# Altium schematic sheet Bus_Interface_for_ABB-Welcome_v2.schdoc
size 400 x 295 mm
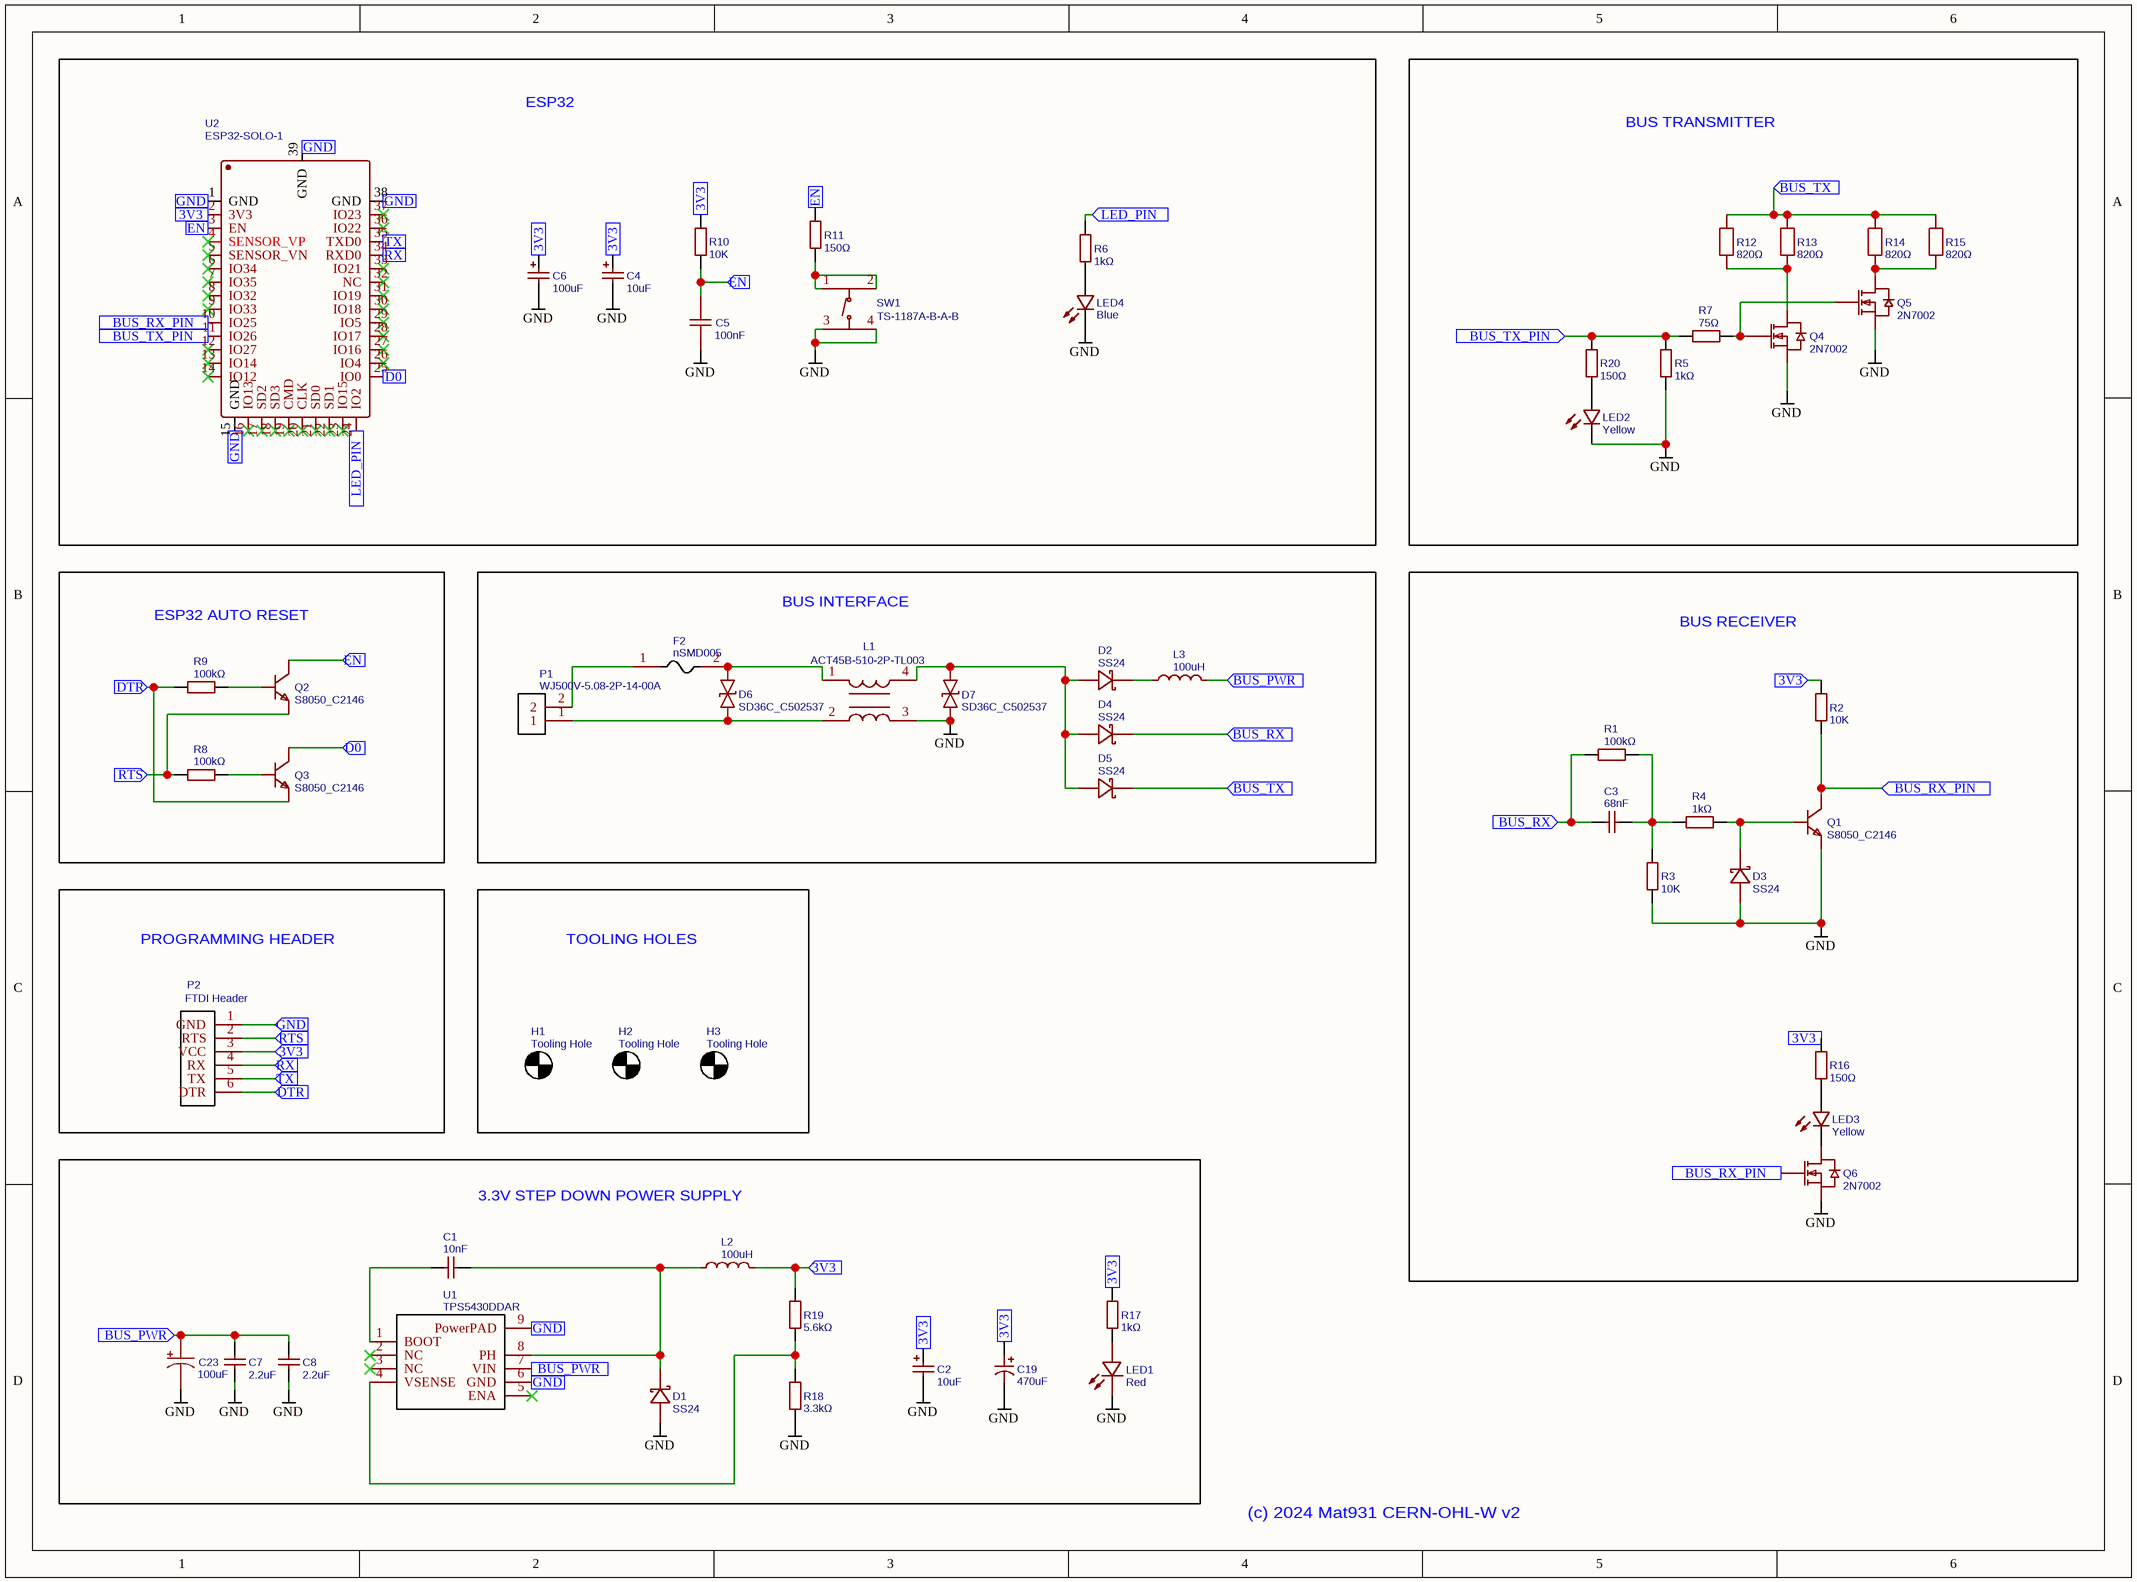
[diagram p0: Bus_Interface_for_ABB-Welcome_v2.schdoc]

## Parts
C1  10nF  [C0603]
C2  10uF  [CAP-SMD_L3.2-W1.6-RD-C7171]
C3  68nF  [C0603]
C4  10uF  [CAP-SMD_L3.2-W1.6-RD-C7171]
C5  100nF  [C0603]
C6  100uF  [CASE-B_3528]
C7  2.2uF  [C1206]
C8  2.2uF  [C1206]
C19  470uF  [CAP-SMD_BD8.0-L8.3-W8.3-LS9.0-FD]
C23  100uF  [CAP-SMD_BD8.0-L8.3-W8.3-RD]
D1  SS24  [SMA_L4.3-W2.6-LS5.0-FD]
D2  SS24  [SMA_L4.3-W2.6-LS5.0-FD]
D3  SS24  [SMA_L4.3-W2.6-LS5.0-FD]
D4  SS24  [SMA_L4.3-W2.6-LS5.0-FD]
D5  SS24  [SMA_L4.3-W2.6-LS5.0-FD]
D6  SD36C_C502537  [SOD-323_L1.7-W1.3-LS2.7-BI]
D7  SD36C_C502537  [SOD-323_L1.7-W1.3-LS2.7-BI]
F2  nSMD005  [F1206]
H1  Tooling Hole  [TOOLING HOLE JLCPCB]
H2  Tooling Hole  [TOOLING HOLE JLCPCB]
H3  Tooling Hole  [TOOLING HOLE JLCPCB]
L1  ACT45B-510-2P-TL003  [IND-SMD_4P-L4.5-W3.2-TL]
L2  100uH  [IND-SMD_L7.1-W6.6]
L3  100uH  [IND-SMD_L7.1-W6.6]
LED1  Red  [LED0603-RD]
LED2  Yellow  [LED0603-RD-YELLOW]
LED3  Yellow  [LED0603-RD-YELLOW]
LED4  Blue  [LED0603-FD_BLUE]
P1  WJ500V-5.08-2P-14-00A  [CONN-TH_2P-P5.00_WJ500V-5.08-2P]
P2  FTDI Header  [FTDI HEADER]
Q1  S8050_C2146  [SOT-23-3_L3.0-W1.7-P0.95-LS2.9-BR]
Q2  S8050_C2146  [SOT-23-3_L3.0-W1.7-P0.95-LS2.9-BR]
Q3  S8050_C2146  [SOT-23-3_L3.0-W1.7-P0.95-LS2.9-BR]
Q4  2N7002  [SOT-23-3_L2.9-W1.3-P1.90-LS2.4-BR]
Q5  2N7002  [SOT-23-3_L2.9-W1.3-P1.90-LS2.4-BR]
Q6  2N7002  [SOT-23-3_L2.9-W1.3-P1.90-LS2.4-BR]
R1  100kΩ  [R0603]
R2  10K  [R0603]
R3  10K  [R0603]
R4  1kΩ  [R0603]
R5  1kΩ  [R0603]
R6  1kΩ  [R0603]
R7  75Ω  [R0603]
R8  100kΩ  [R0603]
R9  100kΩ  [R0603]
R10  10K  [R0603]
R11  150Ω  [R0603]
R12  820Ω  [R2512]
R13  820Ω  [R2512]
R14  820Ω  [R2512]
R15  820Ω  [R2512]
R16  150Ω  [R0603]
R17  1kΩ  [R0603]
R18  3.3kΩ  [R0603]
R19  5.6kΩ  [R0603]
R20  150Ω  [R0603]
SW1  TS-1187A-B-A-B  [SW-SMD_4P-L5.1-W5.1-P3.70-LS6.5-TL-2]
U1  TPS5430DDAR  [ESOP-8_L4.9-W3.9-P1.27-LS6.0-TL-EP]
U2  ESP32-SOLO-1  [WIFIM-SMD_38P-L25.5-W18.0-P1.27]

## Blocks framed on the sheet
ESP32: C4-C6 LED4 R6 R10 R11 SW1 U2
BUS TRANSMITTER: LED2 Q4 Q5 R5 R7 R12-R15 R20
ESP32 AUTO RESET: Q2 Q3 R8 R9
BUS INTERFACE: D2 D4-D7 F2 L1 L3 P1
BUS RECEIVER: C3 D3 LED3 Q1 Q6 R1-R4 R16
PROGRAMMING HEADER: P2
TOOLING HOLES: H1-H3
3.3V STEP DOWN POWER SUPPLY: C1 C2 C7 C8 C19 C23 D1 L2 LED1 R17-R19 U1

## Ports
3V3 (in), BUS_PWR (in), BUS_RX (in), BUS_RX_PIN (in), BUS_TX (in), BUS_TX_PIN (in), D0 (in), DTR (in), EN (in), GND (in), LED_PIN (in), RTS (in), RX (in), TX (in)

## Nets
GND: C2.2 C4.2 C5.1 C6.2 C7.1 C8.1 C19.2 C23.2 D1.1(A) D3.1(A) D7.1 L1.3 LED1.1(K) LED2.1(C) LED4.1(C) Q1.2(E) Q4.2(S) Q5.2(S) Q6.2(S) R3.1 R5.1 R18.1 SW1.3(C) SW1.4(D)
3V3: C2.1 C4.1 C6.1 C19.1 L2.2 P2.3(VCC) R2.2 R10.2 R16.2 R17.2 R19.2 U2.2(3V3) ; port 3V3
BUS_PWR: C7.2 C8.2 C23.1 L3.2 U1.7(VIN) ; port BUS_PWR
BUS_RX: C3.1 D4.2(K) R1.1 ; port BUS_RX
BUS_RX_PIN: Q1.3(C) Q6.1(G) R2.1 U2.10(IO25) ; port BUS_RX_PIN
BUS_TX: D5.2(K) R12.2 R13.2 R14.2 R15.2 ; port BUS_TX
BUS_TX_PIN: R5.2 R7.1 R20.2 U2.11(IO26) ; port BUS_TX_PIN
D0: Q3.3(C) U2.25(IO0) ; port D0
DTR: P2.6(DTR) Q3.2(E) R9.1 ; port DTR
EN: C5.2 Q2.3(C) R10.1 R11.2 U2.3(EN) ; port EN
GND: P2.1(GND) U1.6(GND) U1.9(PowerPAD) U2.1(GND) U2.15(GND) U2.38(GND) U2.39(GND) ; port GND  [a separate net that carries the same name]
LED_PIN: R6.2 U2.24(IO2) ; port LED_PIN
RTS: P2.2(RTS) Q2.2(E) R8.1 ; port RTS
RX: P2.4(RX) U2.34(RXD0) ; port RX
TX: P2.5(TX) U2.35(TXD0) ; port TX
NetC1_1: C1.1 D1.2(K) L2.1 U1.8(PH)
NetC1_2: C1.2 U1.1(BOOT)
NetC3_2: C3.2 R1.2 R3.2 R4.1
NetD2_1: D2.1(A) D4.1(A) D5.1(A) D7.2 L1.4
NetD2_2: D2.2(K) L3.1
NetD3_2: D3.2(K) Q1.1(B) R4.2
NetD6_1: D6.1 L1.2 P1.1
NetD6_2: D6.2 F2.2 L1.1
NetF2_1: F2.1 P1.2
NetLED1_2: LED1.2(A) R17.1
NetLED2_2: LED2.2(A) R20.1
NetLED3_1: LED3.1(C) Q6.3(D)
NetLED3_2: LED3.2(A) R16.1
NetLED4_2: LED4.2(A) R6.1
NetQ2_1: Q2.1(B) R9.2
NetQ3_1: Q3.1(B) R8.2
NetQ4_1: Q4.1(G) Q5.1(G) R7.2
NetQ4_3: Q4.3(D) R12.1 R13.1
NetQ5_3: Q5.3(D) R14.1 R15.1
NetR11_1: R11.1 SW1.1(A) SW1.2(B)
NetR18_2: R18.2 R19.1 U1.4(VSENSE)

Not connected (* = marked no-connect by the designer): U1 2(NC)* 3(NC)* 5(ENA)*; U2 4(SENSOR_VP)* 5(SENSOR_VN)* 6(IO34)* 7(IO35)* 8(IO32)* 9(IO33)* 12(IO27)* 13(IO14)* 14(IO12)* 16(IO13)* 17(SD2)* 18(SD3)* 19(CMD)* 20(CLK)* 21(SD0)* 22(SD1)* 23(IO15)* 26(IO4)* 27(IO16)* 28(IO17)* 29(IO5)* 30(IO18)* 31(IO19)* 32(NC)* 33(IO21)* 36(IO22)* 37(IO23)*

## Notes on the sheet
- (c) 2024 Mat931 CERN-OHL-W v2

## Library data of the parts
C1 = 10nF: Manufacturer: FH(风华); Manufacturer Part: 0603B103K500NT; nameAlias: Value; Supplier: LCSC; Supplier Part: C57112; JLCPCB Part Class: Basic Part; spicePre: C; spiceSymbolName: 0603B103K500NT
C2 C4 = 10uF: Manufacturer: Kyocera AVX; Manufacturer Part: TAJA106K016RNJ; nameAlias: Value; Supplier: LCSC; Supplier Part: C7171; JLCPCB Part Class: Basic Part; spicePre: C; spiceSymbolName: TAJA106K016RNJ
C3 = 68nF: Manufacturer Part: CL10B683KB8NNNC; Manufacturer: SAMSUNG(三星); nameAlias: Value; Supplier: LCSC; Supplier Part: C31658; JLCPCB Part Class: Basic Part; spicePre: C; spiceSymbolName: CL10B683KB8NNNC
C5 = 100nF: Manufacturer: YAGEO(国巨); Manufacturer Part: CC0603KRX7R9BB104; nameAlias: Capacitance; Supplier: LCSC; Supplier Part: C14663; spicePre: C; spiceSymbolName: GRM188R71H104KA93D; JLCPCB Part Class: Basic Part
C6 = 100uF: Manufacturer: Kyocera AVX; Manufacturer Part: TAJB107K006RNJ; nameAlias: Value; Supplier: LCSC; Supplier Part: C16133; JLCPCB Part Class: Basic Part; spicePre: C; spiceSymbolName: TAJB107K006RNJ
C7 C8 = 2.2uF: Manufacturer Part: CL31B225KBHNNNE; Manufacturer: SAMSUNG(三星); nameAlias: Value; Supplier: LCSC; Supplier Part: C50254; JLCPCB Part Class: Basic Part; spicePre: C; spiceSymbolName: CL31B225KBHNNNE
C19 = 470uF: Manufacturer: KNSCHA(科尼盛); Manufacturer Part: RVT470UF16V67RV0031; nameAlias: Value; Contributor: LCSC; Supplier: LCSC; Supplier Part: C2858857; JLCPCB Part Class: Extended Part; spicePre: C; spiceSymbolName: RVT470UF16V67RV0031
C23 = 100uF: Manufacturer: Lelon; Manufacturer Part: VEJ101M1HTR-0810; nameAlias: Capacitance; Contributor: LCSC; SMT Type: Extend; Supplier: LCSC; Supplier Part: C176665; LCSC Assembly: Yes; spicePre: C; spiceSymbolName: VEJ101M1HTR-0810
D1-D5 = SS24: Manufacturer: 宏迦橙; Contributor: lcsc; Supplier: LCSC; Supplier Part: C7420362; Manufacturer Part: SS24; JLCPCB Part Class: Extended Part; spicePre: D; spiceSymbolName: SS24_C7420362
  D2-D5: link: https://lcsc.com/eda_search?q=C7420362&%26type=1&ref=editor
D6 D7 = SD36C_C502537: Manufacturer: MDD; Manufacturer Part: SD36C; Contributor: LCSC; Supplier: LCSC; Supplier Part: C502537; JLCPCB Part Class: Extended Part; spicePre: D; spiceSymbolName: SD36C_C502537
F2 = nSMD005: Manufacturer: TECHFUSE; SMT Type: Extend; Supplier: LCSC; Manufacturer Part: nSMD005; image: //image.lceda.cn/szlcsc/C70064.jpg; Supplier Part: C70064; LCSC Assembly: Yes; spicePre: F; spiceSymbolName: nSMD005
H1-H3 = Tooling Hole: Contributor: renansp; spicePre: H; spiceSymbolName: Tooling Hole
L1 = ACT45B-510-2P-TL003: Manufacturer: TDK; Supplier: LCSC; Manufacturer Part: ACT45B-510-2P-TL003; Supplier Part: C76584; spicePre: L; spiceSymbolName: ACT45B-510-2P-TL003
L2 L3 = 100uH: Manufacturer: SXN(顺翔诺); Manufacturer Part: SMMS0650-101M; nameAlias: Value; Contributor: LCSC; Supplier: LCSC; Supplier Part: C2894722; JLCPCB Part Class: Extended Part; spicePre: L; spiceSymbolName: SMMS0650-101M
LED1 = Red: Manufacturer: KENTO; Manufacturer Part: KT-0603R; Supplier: LCSC; Supplier Part: C2286; JLCPCB Part Class: Basic Part; spicePre: L; spiceSymbolName: KT-0603R
LED2 LED3 = Yellow: Manufacturer: EVERLIGHT(亿光); Manufacturer Part: 19-213/Y2C-CQ2R2L/3T(CY); Supplier: LCSC; Supplier Part: C72038; JLCPCB Part Class: Basic Part; spicePre: L; spiceSymbolName: 19-213/Y2C-CQ2R2L/3T(CY)
LED4 = Blue: Manufacturer: EVERLIGHT(亿光); Manufacturer Part: 19-217/BHC-ZL1M2RY/3T; Supplier: LCSC; Supplier Part: C72041; JLCPCB Part Class: Basic Part; spicePre: L; spiceSymbolName: 19-217/BHC-ZL1M2RY/3T
P1 = WJ500V-5.08-2P-14-00A: Manufacturer: KANGNEX(康奈克斯电气); Supplier: LCSC; Manufacturer Part: WJ500V-5.08-2P; Supplier Part: C8465; JLCPCB Part Class: Extended Part; spicePre: P; spiceSymbolName: WJ500V-5.08-2P-14-00A
P2 = FTDI Header: Contributor: Julian42; spicePre: P; spiceSymbolName: FTDI Header
Q1-Q3 = S8050_C2146: Manufacturer: CJ(江苏长电/长晶); Manufacturer Part: S8050 J3Y; Supplier: LCSC; Supplier Part: C2146; JLCPCB Part Class: Basic Part; spicePre: Q; spiceSymbolName: S8050_C2146
Q4-Q6 = 2N7002: Manufacturer: CJ(江苏长电/长晶); Supplier: LCSC; Manufacturer Part: 2N7002; Supplier Part: C8545; JLCPCB Part Class: Basic Part; spicePre: Q; spiceSymbolName: 2N7002
R1 R8 R9 = 100kΩ: Manufacturer: UNI-ROYAL(厚声); Manufacturer Part: 0603WAF1003T5E; nameAlias: Value; Supplier: LCSC; Supplier Part: C25803; JLCPCB Part Class: Basic Part; spicePre: R; spiceSymbolName: 0603WAF1003T5E
R2 R3 R10 = 10K: Manufacturer: UniOhm; Manufacturer Part: 0603WAF1002T5E; nameAlias: Resistance (Ohms); SMT Type: Basic; Supplier: LCSC; LCSC Assembly: Yes; Supplier Part: C25804; spicePre: R; spiceSymbolName: 0603WAF1002T5E
R4-R6 R17 = 1kΩ: Manufacturer: UNI-ROYAL(厚声); Manufacturer Part: 0603WAF1001T5E; nameAlias: Value; Supplier: LCSC; Supplier Part: C21190; JLCPCB Part Class: Basic Part; spicePre: R; spiceSymbolName: 0603WAF1001T5E
  R4 R5: link: https://lcsc.com/eda_search?q=C21190&%26type=1&ref=editor
R7 = 75Ω: Manufacturer: UNI-ROYAL(厚声); Manufacturer Part: 0603WAF750JT5E; nameAlias: Value; Supplier: LCSC; Supplier Part: C4275; JLCPCB Part Class: Basic Part; spicePre: R; spiceSymbolName: 0603WAF750JT5E
R11 R16 R20 = 150Ω: Manufacturer: UNI-ROYAL(厚声); Manufacturer Part: 0603WAF1500T5E; nameAlias: Value; Supplier: LCSC; Supplier Part: C22808; JLCPCB Part Class: Basic Part; spicePre: R
  R11: spiceSymbolName: 0603WAF1500T5E
  R16 R20: spiceSymbolName: 0603WAF1001T5E
R12-R15 = 820Ω: Manufacturer: FOJAN(富捷); Manufacturer Part: FRC2512F8200TS; nameAlias: Value; Contributor: lcsc; Supplier: LCSC; Supplier Part: C2999541; JLCPCB Part Class: Extended Part; spicePre: R; spiceSymbolName: FRC2512F8200TS
R18 = 3.3kΩ: Manufacturer: UNI-ROYAL(厚声); Manufacturer Part: 0603WAF3301T5E; nameAlias: Value; Supplier: LCSC; Supplier Part: C22978; JLCPCB Part Class: Basic Part; spicePre: R; spiceSymbolName: 0603WAF3301T5E
R19 = 5.6kΩ: Manufacturer: UNI-ROYAL(厚声); Manufacturer Part: 0603WAF5601T5E; nameAlias: Value; Supplier: LCSC; Supplier Part: C23189; JLCPCB Part Class: Basic Part; spicePre: R; spiceSymbolName: 0603WAF5601T5E
SW1 = TS-1187A-B-A-B: Manufacturer: XKB Connectivity(中国星坤); Contributor: LCSC; Supplier: LCSC; Supplier Part: C318884; Manufacturer Part: TS-1187A-B-A-B; JLCPCB Part Class: Basic Part; spicePre: S; spiceSymbolName: TS-1187A-B-A-B
U1 = TPS5430DDAR: Manufacturer: TI(德州仪器); Supplier: LCSC; Manufacturer Part: TPS5430DDAR; Supplier Part: C9864; JLCPCB Part Class: Basic Part; spicePre: U; spiceSymbolName: TPS5430DDAR
U2 = ESP32-SOLO-1: Manufacturer: ESPRESSIF(乐鑫); Contributor: LCSC; Supplier: LCSC; Supplier Part: C473005; Manufacturer Part: ESP32-SOLO-1; JLCPCB Part Class: Extended Part; spicePre: U; spiceSymbolName: ESP32-SOLO-1